# Altium schematic sheet Simplified.SchDoc
size A
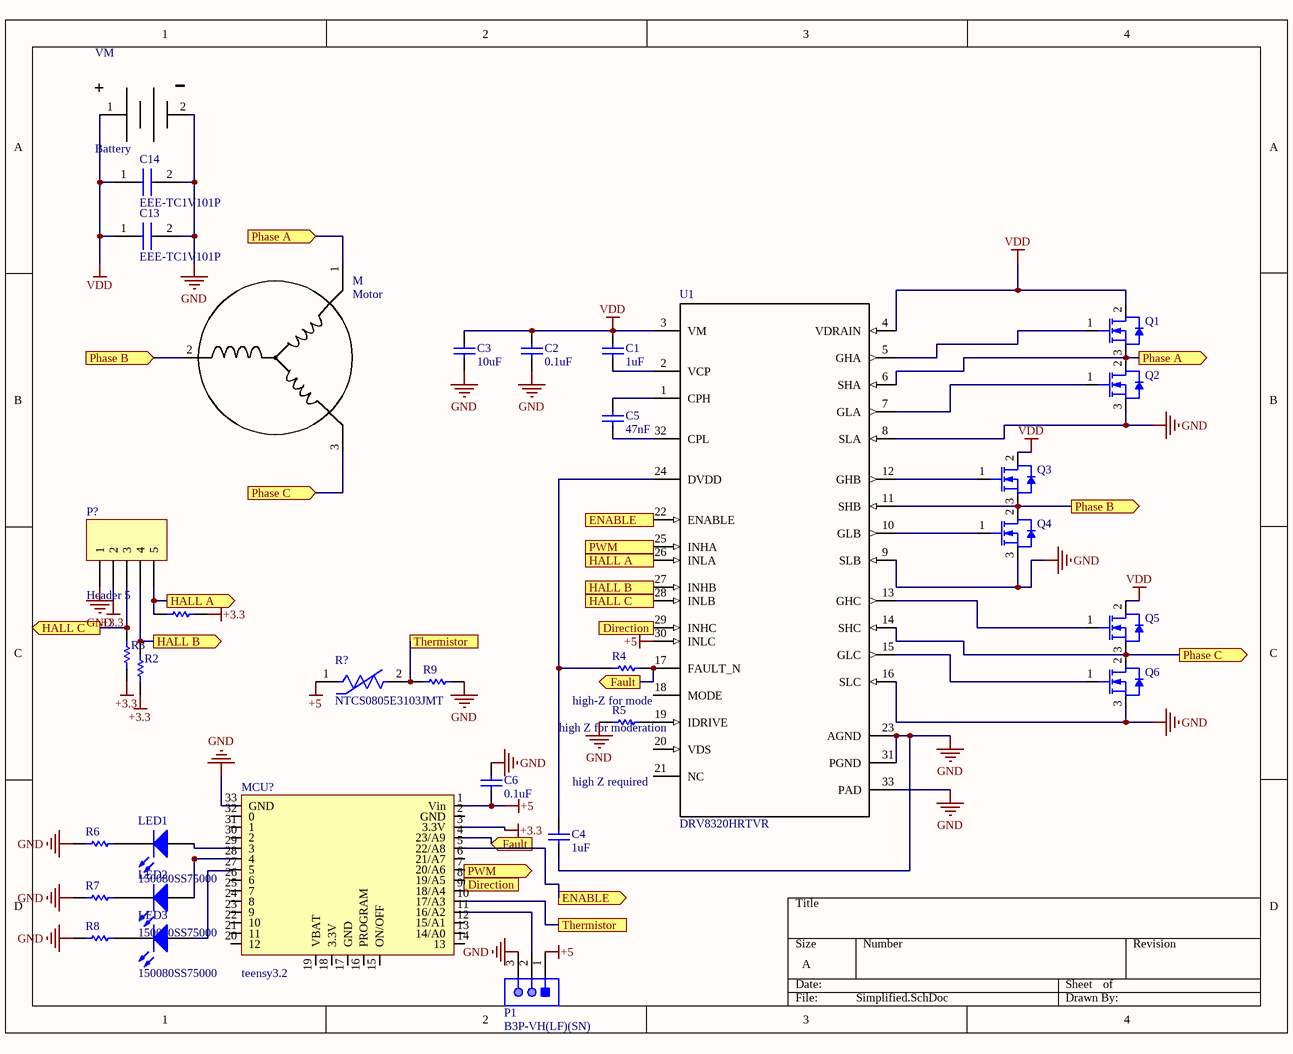
[diagram p0: Simplified.SchDoc]

## Parts
C1  1uF  [CAPC2013X135X45ML10T25]
C2  0.1uF  [CAPC2013X135X45ML10T25]
C3  10uF  [CAPC2013X135X50LL10T20]
C4  1uF  [CAPC2013X135X45ML10T25]
C5  47nF  [CAPC2013X135X45ML10T25]
C6  0.1uF  [CAPC2013X135X45ML10T25]
C13  EEE-TC1V101P  [CAPAE830X1050N]
C14  EEE-TC1V101P  [CAPAE830X1050N]
LED1  150080SS75000  [0805_A]
LED2  150080SS75000  [0805_A]
LED3  150080SS75000  [0805_A]
M  Motor  [Motor]
MCU?  teensy3.2  [teensy3.2]
P1  B3P-VH(LF)(SN)  [JST-B3P-VH(LF)(SN)-3_V]
P?  Header 5  [HDR1X5]
Q1  INFINEON  [MOSFET-2]  (value not drawn)
Q2  INFINEON  [MOSFET-2]  (value not drawn)
Q3  INFINEON  [MOSFET-2]  (value not drawn)
Q4  INFINEON  [MOSFET-2]  (value not drawn)
Q5  INFINEON  [MOSFET-2]  (value not drawn)
Q6  INFINEON  [MOSFET-2]  (value not drawn)
R1  CRCW08050000Z0EA  [RESC2013X50X30LL20T20]  (value not drawn)
R2  CRCW08050000Z0EA  [RESC2013X50X30LL20T20]  (value not drawn)
R3  CRCW08050000Z0EA  [RESC2013X50X30LL20T20]  (value not drawn)
R4  CRCW08050000Z0EA  [RESC2013X50X30LL20T20]  (value not drawn)
R5  CRCW08050000Z0EA  [RESC2013X50X30LL20T20]  (value not drawn)
R6  CRCW08050000Z0EA  [RESC2013X50X30LL20T20]  (value not drawn)
R7  CRCW08050000Z0EA  [RESC2013X50X30LL20T20]  (value not drawn)
R8  CRCW08050000Z0EA  [RESC2013X50X30LL20T20]  (value not drawn)
R9  CRCW08050000Z0EA  [RESC2013X50X30LL20T20]  (value not drawn)
R?  NTCS0805E3103JMT  [FP-NTCS0805-MFG]
U1  DRV8320HRTVR  [RTV0032E]
VM  Battery  [*AMASS_XT60-M]

## Ports
Direction, ENABLE (in), ENABLE (out), Fault (in), Fault (out), HALL A (in), HALL A (out), HALL B (in), HALL B (out), HALL C (in), HALL C (out), Phase A (in), Phase A (out), Phase B (in), Phase B (out), Phase C (in), Phase C (out), PWM (in), PWM (out), Thermistor

## Nets
+3.3: MCU?.3(3.3V) P?.2 R1.1 R2.1 R3.1
+5: C6.1 MCU?.1(Vin) P1.1 R?.1 U1.30(INLC)
GND: C2.1 C3.1 C4.1 C6.2 C13.2(-) C14.2(-) MCU?.33(GND) P1.3 P?.1 Q2.3(S) Q4.3(S) Q6.3(S) R5.2 R6.2 R7.2 R8.2 R9.1 U1.8(SLA) U1.9(SLB) U1.16(SLC) U1.23(AGND) U1.31(PGND) U1.33(PAD) VM.2
VDD: C1.2 C2.2 C3.2 C13.1(+) C14.1(+) Q1.2(D) Q3.2(D) Q5.2(D) U1.3(VM) U1.4(VDRAIN) VM.1
Direction: MCU?.8(19/A5) U1.29(INHC) ; port Direction
ENABLE: MCU?.5(22/A8) U1.22(ENABLE) ; port ENABLE
Fault: MCU?.4(23/A9) R4.1 U1.17(FAULT_N) ; port Fault
HALL A: P?.5 R1.2 U1.26(INLA) ; port HALL A
HALL B: P?.4 R2.2 U1.27(INHB) ; port HALL B
HALL C: P?.3 R3.2 U1.28(INLB) ; port HALL C
Phase A: M.1(A) Q1.3(S) Q2.2(D) U1.6(SHA) ; port Phase A
Phase B: M.2(B) Q3.3(S) Q4.2(D) U1.11(SHB) ; port Phase B
Phase C: M.3(C) Q5.3(S) Q6.2(D) U1.14(SHC) ; port Phase C
PWM: MCU?.7(20/A6) U1.25(INHA) ; port PWM
Thermistor: MCU?.10(17/A3) R9.2 R?.2 ; port Thermistor
NetC1_1: C1.1 U1.2(VCP)
NetC4_2: C4.2 R4.2 U1.24(DVDD)
NetC5_1: C5.1 U1.32(CPL)
NetC5_2: C5.2 U1.1(CPH)
NetLED1_1: LED1.1(K) R6.1
NetLED1_2: LED1.2(A) MCU?.29(3)
NetLED2_1: LED2.1(K) R7.1
NetLED2_2: LED2.2(A) MCU?.28(4)
NetLED3_1: LED3.1(K) R8.1
NetLED3_2: LED3.2(A) MCU?.27(5)
NetMCU?_11: MCU?.11(16/A2) P1.2
NetQ1_1: Q1.1(G) U1.5(GHA)
NetQ2_1: Q2.1(G) U1.7(GLA)
NetQ3_1: Q3.1(G) U1.12(GHB)
NetQ4_1: Q4.1(G) U1.10(GLB)
NetQ5_1: Q5.1(G) U1.13(GHC)
NetQ6_1: Q6.1(G) U1.15(GLC)
NetR5_1: R5.1 U1.19(IDRIVE)

Not connected (* = marked no-connect by the designer): MCU? 2(GND) 6(21/A7) 9(18/A4) 12(15/A1) 13(14/A0) 14(13) 15(ON/OFF) 16(PROGRAM) 17(GND) 18(3.3V) 19(VBAT) 20(12) 21(11) 22(10) 23(9) 24(8) 25(7) 26(6) 30(2) 31(1) 32(0); U1 18(MODE) 20(VDS) 21(NC)

## Notes on the sheet
- high-Z for mode
- high Z for moderation
- (near U1) high Z required
- (in symbol Battery) -; +

## Library data of the parts
C1 C4 C5 = CMP-2000-04946-1: Multilayer Ceramic Capacitor, 1 uF, +/- 10%, 16 V, -55 to 125 degC, 0805 (2012 Metric), RoHS, Tape and Reel; Manufacturer: Murata; Dielectric: X7R; Capacitance: 1µF; Rated Voltage: 16V; Package Description: 2-Pin Surface Mount Device, Body 2 x 1.25 mm; Datasheet Version: Mar-08; Package Reference: 805; Datasheet URL: https://datasheet.ciiva.com/34302/1858922-34302874.pdf; Case Size/Dimension: 0805; Tolerance (%): ±10%; Manufacturer URL: http://www.murata.com/
C2 C6 = CMP-2100-03644-1: Chip Capacitor, 0.1 uF, +/- 10%, 50 V, -55 to 125 degC, 0805 (2012 Metric), RoHS, Tape and Reel; Manufacturer: Murata; Voltage: 50V; Capacitance: 100nF; Insulation Resistance: 10GR; Dielectric Material: Ceramic; Dielectric: X7R; Package Description: 2-Pin Surface Mount Device, Body 2 x 1.25 mm; Manufacturer URL: http://www.murata.com/; Case Code (Imperial): 0805; Datasheet URL: http://psearch.en.murata.com/capacitor/product/GRM21BR71H104KA01%23.pdf; Termination: SMD/SMT; Lead Free: LeadFree; Package Quantity: 1; Mount: SurfaceMount; REACH SVHC: Unknown; Thickness: 0.053inch; Height: 1.25mm; Case/Package: 0805; Voltage Rating: 50V; Width: 0.049inch; Case Code (Metric): 2012; Material: Ceramic; Min Operating Temperature: -55degC; RoHSCompliant: true; Datasheet Version: 42675.0; Voltage Rating (DC): 50V; Tolerance: 10%; Package Reference: 0805; Depth: 1.25mm; Length: 2mm; Max Operating Temperature: 125degC; Packaging: TapeandReel; Number of Pins: 2; Radiation Hardening: No
C3 = CMP-2007-03453-1: Manufacturer: Murata; Part Number: GRM21BR61C106KE15L
C13 C14 = EEE-TC1V101P: Capacitor; Manufacturer_Name: Panasonic; Datasheet Link: https://www.mouser.in/datasheet/2/315/ABA0000C678-951953.pdf; Height: 10.5mm; Manufacturer_Part_Number: EEE-TC1V101P; Arrow Part Number: EEE-TC1V101P; Arrow Price/Stock: https://www.arrow.com/en/products/eee-tc1v101p/panasonic; Mouser Part Number: 667-EEE-TC1V101P; Mouser Price/Stock: https://www.mouser.com/Search/Refine.aspx?Keyword=667-EEE-TC1V101P
LED1-LED3 = CMP-1426-00010-1: SMD mono-color Chip LED, WL-SMCW, Super Red; Manufacturer: Wuerth Elektronik; PackageReference: 0805_A; ComponentLink2URL: http://katalog.we-online.com/led/datasheet/150080SS75000.pdf; ComponentLink1URL: http://www.we-online.com; Color: Super Red; ComponentLink2Description: Datasheet; ComponentLink1Description: Manufacturer URL; PartNumber: 150080SS75000
P1 = CMP-1755-00003-1: Male Header, Pitch 3.96 mm, 1 x 3 Position, Height 10.9 mm, Tail Length 3.7 mm, -25 to 85 degC, RoHS, Bulk; PackageReference: B3P-VH(LF)(SN); ComponentLink2Description: Datasheet; ComponentLink2URL: http://www.jst-mfg.com/product/pdf/eng/eVH.pdf; DatasheetVersion: May-16; PackageDescription: Male Header, Pitch 3.96 mm, 1 x 3 Position, Height 10.9 mm, Tail Length 3.7 mm; ComponentLink1URL: http://www.jst.com/home2.html; ComponentLink1Description: Manufacturer URL
P? = Header 5: Header, 5-Pin; LatestRevisionDate: 17-Jul-2002; LatestRevisionNote: Re-released for DXP Platform.; Publisher: Altium Limited
R1-R9 = CMP-2001-04896-1: Manufacturer: Vishay Dale; Part Number: CRCW08050000Z0EA
R? = CMP-02404-000004-1: THERMISTOR NTC 10KOHM 3570K 0805; Manufacturer: Vishay BC Components; Automotive Grade: Grade 0; Power Rating: 210mW; B Tolerance: 3%; Value: 10kΩ; Tolerance: 5%; Automotive: Yes; Category: Res; Lead Free: Yes; Height: 0.95mm; RoHS: TRUE; Temperature Range Low: -40°C; Temperature: -40°C to +150°C; Device Class L2: Resistors; Digikey Description: THERMISTOR NTC 10KOHM 3570K 0805; ComponentLink2URL: http://www.vishay.com/docs/29044/ntcs0805e3t.pdf; Mouser Description: Thermistors - NTC 10K OHM 5%; Octopart: https://octopart.com/ntcs0805e3103jmt-vishay-39723061; Package: NTCS0805; B 25 85: 3570K; Series: NTCS0805E; Resistance: 10kΩ; Device Class L1: Passive Components; Ipc Land Pattern Name: RESC200125X80; Manufacturer Part Number: NTCS0805E3103JMT; Device Class L3: Thermistors; ComponentLink2Description: Datasheet; Temperature Range High: +150°C
U1 = DRV8320HRTVR: No Description Available; Manufacturer: Texas Instruments; PartNumber: DRV8320HRTVR; RefDes: RefDes; Type: DEV; Value: Value; Copyright: Copyright (C) 2018 Accelerated Designs. All rights reserved